# Altium schematic sheet 6_MISC.SchDoc: SmartHalo V1.0 Rev1 - Misc
size B; Author: Sébastien Gélinas; Organization: CycleLabs Solutions Inc.; Address1: 5445 de Gaspé; Address2: Montréal, QC; Address3: Canada; Address4: H2T 3B2; Revision: 1; SheetNumber: 6; SheetTotal: 8
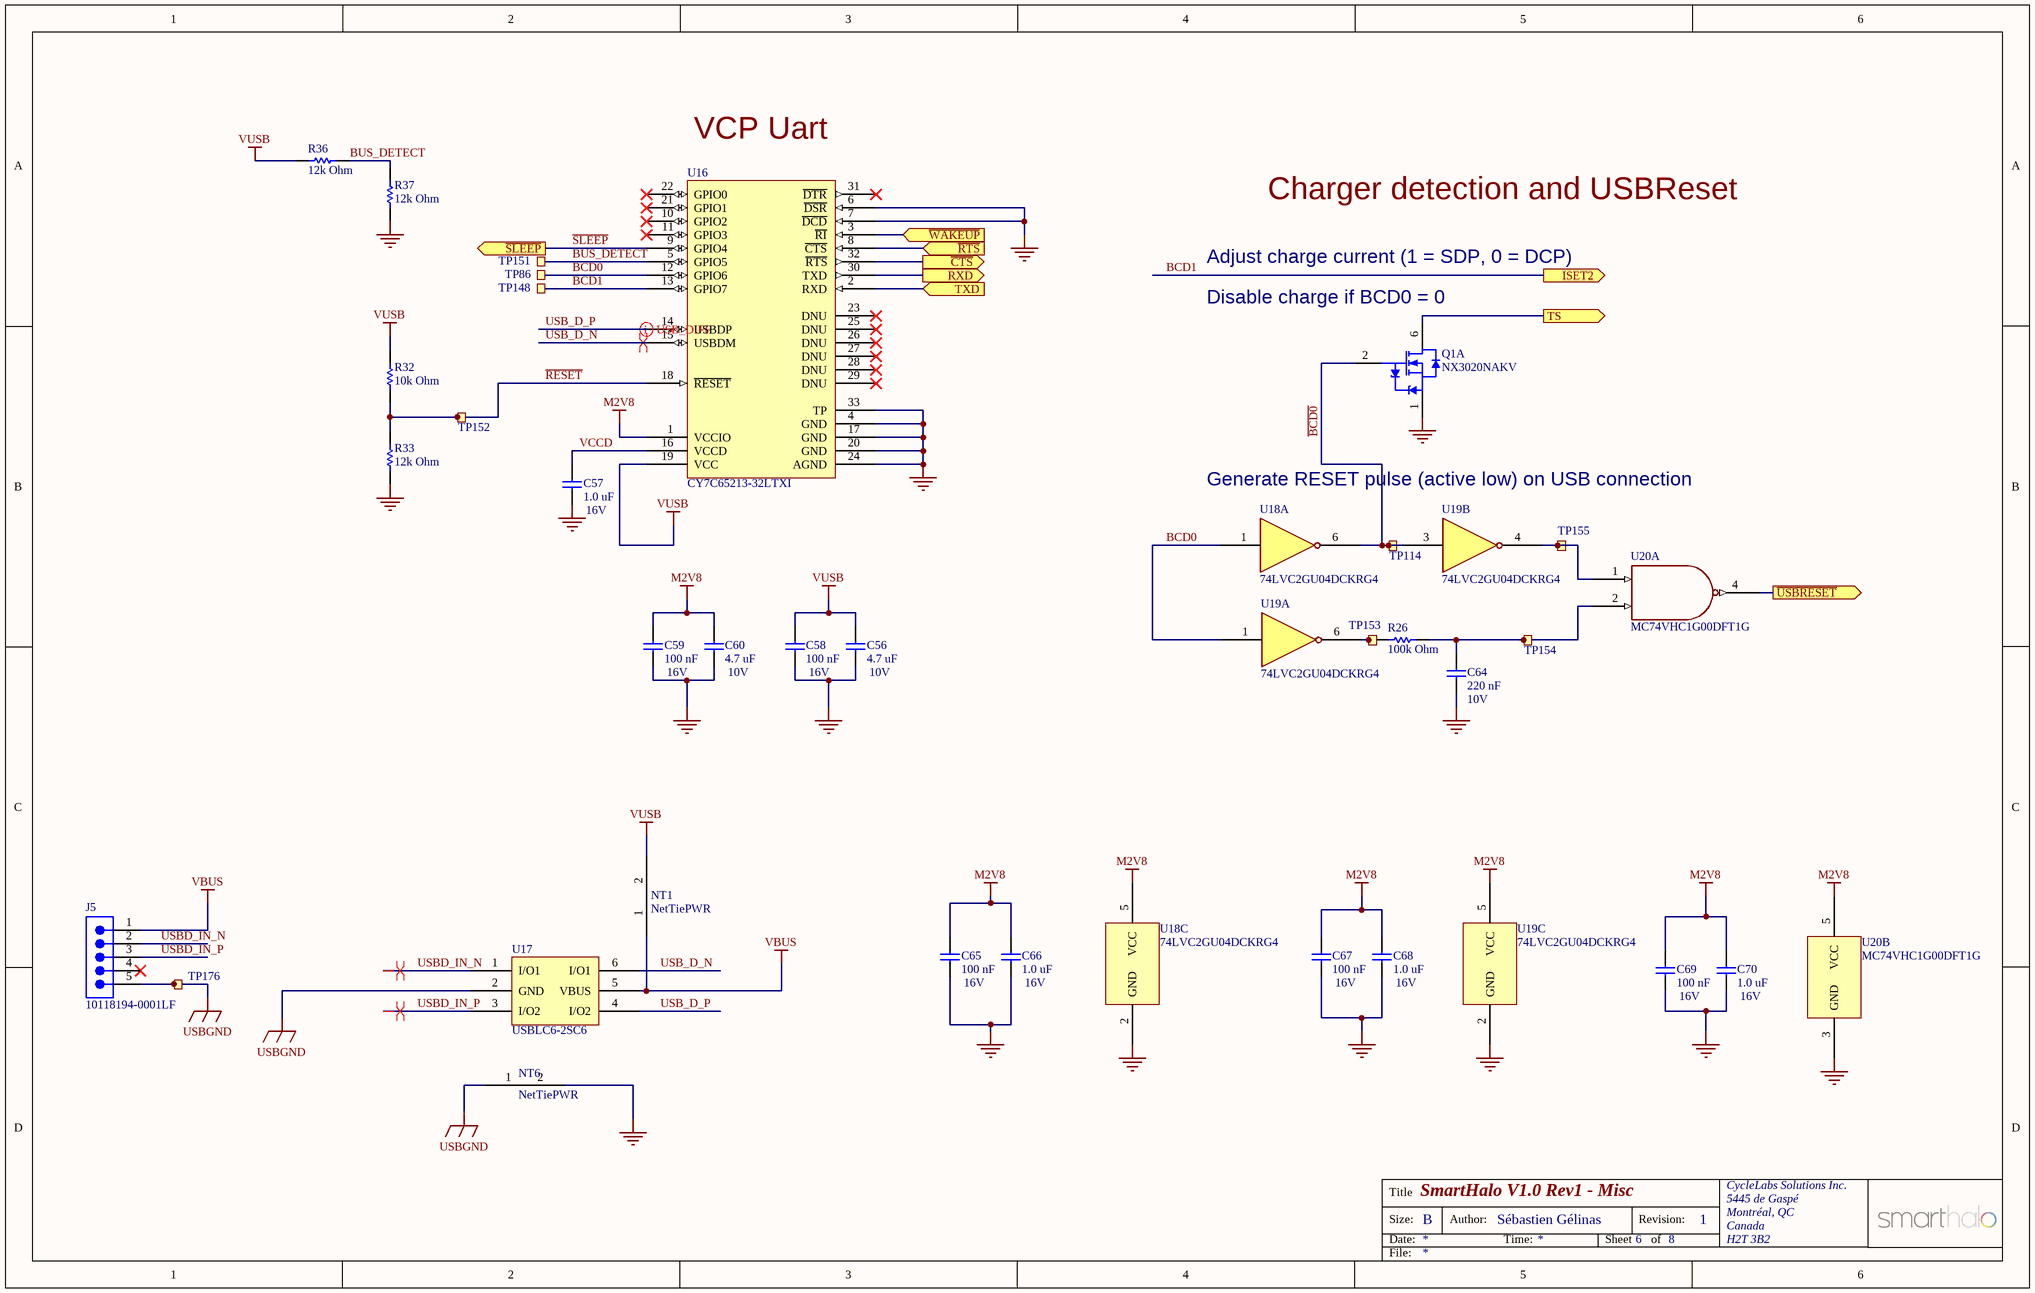
[diagram p0: 6_MISC.SchDoc]

## Parts
C56  4.7 uF  Voltage Rating: 10V  [Varitron_CAP0603]
C57  1.0 uF  Voltage Rating: 16V  [Varitron_CAP0603]
C58  100 nF  Voltage Rating: 16V  [Varitron_CAP0402]
C59  100 nF  Voltage Rating: 16V  [Varitron_CAP0402]
C60  4.7 uF  Voltage Rating: 10V  [Varitron_CAP0603]
C64  220 nF  Voltage Rating: 10V  [Varitron_CAP0402]
C65  100 nF  Voltage Rating: 16V  [Varitron_CAP0402]
C66  1.0 uF  Voltage Rating: 16V  [Varitron_CAP0603]
C67  100 nF  Voltage Rating: 16V  [Varitron_CAP0402]
C68  1.0 uF  Voltage Rating: 16V  [Varitron_CAP0603]
C69  100 nF  Voltage Rating: 16V  [Varitron_CAP0402]
C70  1.0 uF  Voltage Rating: 16V  [Varitron_CAP0603]
J5  10118194-0001LF  [10118194-0001LF]
NT1  NetTiePWR  [NetTiePWR]  (net tie, no BOM)
NT6  NetTiePWR  [NetTiePWR]  (net tie, no BOM)
Q1  NX3020NAKV  [SOT666]  (part A of 2)
R26  100k Ohm  [Varitron_RES0402]
R32  10k Ohm  [Varitron_RES0402]
R33  12k Ohm  [Varitron_RES0402]
R36  12k Ohm  [Varitron_RES0402]
R37  12k Ohm  [Varitron_RES0402]
TP86  TP86  [TESTPAD-TH-35mils]  (value not drawn)  (no BOM)
TP114  TP114  [TESTPAD-TH-35mils]  (value not drawn)  (no BOM)
TP148  TP148  [TESTPAD-TH-35mils]  (value not drawn)  (no BOM)
TP151  TP151  [TESTPAD-TH-35mils]  (value not drawn)  (no BOM)
TP152  TP152  [TESTPAD-TH-35mils]  (value not drawn)  (no BOM)
TP153  TP153  [TESTPAD-TH-35mils]  (value not drawn)  (no BOM)
TP154  TP154  [TESTPAD-TH-35mils]  (value not drawn)  (no BOM)
TP155  TP155  [TESTPAD-TH-35mils]  (value not drawn)  (no BOM)
TP176  TP176  [TESTPAD-TH-35mils]  (value not drawn)  (no BOM)
U16  CY7C65213-32LTXI  [QFN-32-TP]
U17  USBLC6-2SC6  [ST-SOT23-6]
U18  74LVC2GU04DCKRG4  [SOT363_SC70_6]  (parts A,C of 3)
U19  74LVC2GU04DCKRG4  [SOT363_SC70_6]  (parts A,B,C of 3)
U20  MC74VHC1G00DFT1G  [SC70-5]  (parts A,B of 2)

## Ports
ISET2 (out), RXD (out), TS (out), TXD (in), ~{CTS} (out), ~{RTS} (in), ~{SLEEP} (out), ~{USBRESET} (out), ~{WAKEUP} (in)

## Nets
GND: C56.2 C57.2 C58.2 C59.2 C60.2 C64.1 C65.2 C66.2 C67.2 C68.2 C69.2 C70.2 NT6.2(NET2) Q1.1(S1) R33.1 R37.2 U16.4(GND) U16.6(~{DSR}) U16.7(~{DCD}) U16.17(GND) U16.20(GND) U16.24(AGND) U16.33(TP) U18.2(GND) U19.2(GND) U20.3(GND)
M2V8: C59.1 C60.1 C65.1 C66.1 C67.1 C68.1 C69.1 C70.1 U16.1(VCCIO) U18.5(VCC) U19.5(VCC) U20.5(VCC)
USBGND: J5.0(ASSY) J5.5 NT6.1(NET1) TP176.1 U17.2(GND)
VBUS: J5.1 NT1.1(NET1) U17.5(VBUS)
VUSB: C56.1 C58.1 NT1.2(NET2) R32.2 R36.2 U16.19(VCC)
~{BCD0}: Q1.2(G1) TP114.1 U18.6 U19.3
BCD0: TP86.1 U16.12(GPIO6) U18.1 U19.1
BCD1: TP148.1 U16.13(GPIO7) ; port ISET2
BUS_DETECT: R36.1 R37.1 TP151.1 U16.5(GPIO5)
~{CTS}: U16.32(~{RTS}) ; port ~{CTS}
~{RESET}: R32.1 R33.2 TP152.1 U16.18(~{RESET})
~{RTS}: U16.8(~{CTS}) ; port ~{RTS}
RXD: U16.30(TXD) ; port RXD
~{SLEEP}: U16.9(GPIO4) ; port ~{SLEEP}
TS: Q1.6(D1) ; port TS
TXD: U16.2(RXD) ; port TXD
~{USBRESET}: U20.4 ; port ~{USBRESET}
USB_D_N: U16.15(USBDM) U17.6(I/O1)
USB_D_P: U16.14(USBDP) U17.4(I/O2)
USBD_IN_N: J5.2 U17.1(I/O1)
USBD_IN_P: J5.3 U17.3(I/O2)
VCCD: C57.1 U16.16(VCCD)
~{WAKEUP}: U16.3(~{RI}) ; port ~{WAKEUP}
NetC64_2: C64.2 R26.1 TP154.1 U20.2
NetR26_2: R26.2 TP153.1 U19.6
NetTP155_1: TP155.1 U19.4 U20.1

Not connected (* = marked no-connect by the designer): J5 4*; U16 10(GPIO2)* 11(GPIO3)* 21(GPIO1)* 22(GPIO0)* 23(DNU)* 25(DNU)* 26(DNU)* 27(DNU)* 28(DNU)* 29(DNU)* 31(~{DTR})*

## Layout directives
differential pair: USB_D_N, USB_D_P, USBD_IN_N, USBD_IN_P

## Notes on the sheet
- (near U16) VCP Uart
- Charger detection and USBReset
- Adjust charge current (1 = SDP, 0 = DCP)
- (near Q1) Disable charge if BCD0 = 0
- Generate RESET pulse (active low) on USB connection
- Title
- Size:
- Date:
- B
- Author:
- Time:
- Sheet
- Revision:
- of
- File:

## Library data of the parts
C56 C60 = Varitron_CAP0603: 4.7 uF 10V X5R 10% 0603 (1608 Metric)  SMD; Manufacturer: Yageo; Manufacturer Part Number: CC0603KRX5R6BB475; SmartHalo Part Number: 630009-01; Case-EIA: 0603; Case-Metric: 1608; Final: Y; Tolerance: 10%; Technology: SMT; Temperature Coefficient: X5R; Part Number: CC0603KRX5R6BB475; Value: 4.7 uF; Supplier: Arrow Electronics; Footprint Name: 0603
C57 C66 C68 C70 = Varitron_CAP0603: 1.0 uF 16V X7R 10% 0603 (1608 Metric)  SMD; Manufacturer: Samsung; Manufacturer Part Number: CL10B105KO8NNNC; SmartHalo Part Number: 630002-01; Case-EIA: 0603; Case-Metric: 1608; Final: Y; Tolerance: 10%; Technology: SMT; Temperature Coefficient: X7R; Part Number: CL10B105KO8NNNC; Value: 1.0 uF; Supplier: Arrow Electronics; Footprint Name: 0603
C58 C59 C65 C67 C69 = Varitron_CAP0402: 100 nF 16V X7R 10% 0402 (1005 Metric)  SMD; Manufacturer: Samsung; Manufacturer Part Number: CL05B104KO5NNNC; SmartHalo Part Number: 630003-01; Case-EIA: 0402; Case-Metric: 1005; Final: Y; Tolerance: 10%; Technology: SMT; Temperature Coefficient: X7R; Part Number: CL05B104KO5NNNC; Value: 100 nF; Supplier: Arrow Electronics; Footprint Name: 0402
C64 = Varitron_CAP0402: 220 nF 10V X7R 10% 0402 (1005 Metric)  SMD; Manufacturer: Samsung; Manufacturer Part Number: CL05B224KP5NNNC; SmartHalo Part Number: 630014-01; Case-EIA: 0402; Case-Metric: 1005; Final: Y; Tolerance: 10%; Technology: SMT; Temperature Coefficient: X7R; Part Number: CL05B224KP5NNNC; Supplier: Arrow Electronics; Footprint Name: 0402; Value: 220 nF
J5 = 10118194-0001LF: Micro USB B Type Receptacle; Manufacturer: Amphenol FCI; SmartHalo Part Number: 630022-01; Final: Y; Manufacturer Part Number: 10118194-0001LF; Part Number: 10118194-0001LF; Footprint Name: CUSTOM(Micro USB connector); Supplier: Arrow Electronics; Supplier Part Number: *
Q1 = NX3020NAKV: 30 V, 200 mA dual N-channel Trench MOSFET; Manufacturer: NXP Semiconductors; SmartHalo Part Number: 630030-01; Final: Y; Manufacturer Part Number: NX3020NAKV; Part Number: NX3020NAKV; Footprint Name: SOT666; Supplier: Arrow Electronics
R26 = Varitron_RES0402: 100k 0.063W 5%  0402 (1005 Metric)  SMD; Manufacturer: Samsung; Manufacturer Part Number: RC1005J104CS; SmartHalo Part Number: 630036-01; Case-Metric: 1005; Case-EIA: 0402; Final: Y; Tolerance: 5%; Technology: SMT; Power: 0.063W; Part Number: RC1005J104CS; Supplier: Arrow Electronics; Footprint Name: 0402; Value: 100k Ohm
R32 = Varitron_RES0402: 10k 0.063W 5%  0402 (1005 Metric)  SMD; Manufacturer: Samsung; Manufacturer Part Number: RC1005J103CS; SmartHalo Part Number: 630041-01; Case-Metric: 1005; Case-EIA: 0402; Final: Y; Tolerance: 5%; Technology: SMT; Power: 0.063W; Part Number: RC1005J103CS; Value: 10k Ohm; Footprint Name: 0402; Supplier: Arrow Electronics
R33 R36 R37 = Varitron_RES0402: 12k 0.063W 5%  0402 (1005 Metric)  SMD; Manufacturer: Samsung; Manufacturer Part Number: RC1005J123CS; SmartHalo Part Number: 630047-01; Case-Metric: 1005; Case-EIA: 0402; Final: Y; Tolerance: 5%; Technology: SMT; Power: 0.063W; Part Number: RC1005J123CS; Value: 12k Ohm; Footprint Name: 0402; Supplier: Arrow Electronics
TP86 TP114 TP148 TP151-TP155 TP176 = TESTPAD_TH_35mils: Testpoint, through hole, 35 mils; Value: TP
U16 = CY7C65213-32LTXI: IC USB TO UART BRIDGE 32QFN; Manufacturer: Cypress; SmartHalo Part Number: 630063-01; Final: Y; Manufacturer Part Number: CY7C65213-32LTXI; Part Number: CY7C65213-32LTXI; Footprint Name: QFN32TP; Supplier: Arrow Electronics
U17 = USBLC6-2SC6: Very low capacitance ESD protection; Manufacturer: STMicroelectronics; SmartHalo Part Number: 630064-01; Manufacturer Part Number: USBLC6-2SC6; Part Number: USBLC6-2SC6; Supplier: Arrow Electronics; Footprint Name: SOT23-6
U18 U19 = 74LVC2GU04DCKRG4: Dual Inverter Gate; Manufacturer: Texas Instruments; SmartHalo Part Number: 630057-01; Final: Y; Manufacturer Part Number: 74LVC2GU04DCKRG4; Part Number: 74LVC2GU04DCKRG4; Supplier: Arrow Electronics; Footprint Name: SOT363
U20 = MC74VHC1G00DFT1G: IC Gate NAND 1 Channel; Manufacturer: ON Semiconductor; SmartHalo Part Number: 630065-01; Final: Y; Part Number: MC74VHC1G00DFT1G; Manufacturer Part Number: MC74VHC1G00DFT1G; Supplier: Arrow Electronics; Footprint Name: SC-70